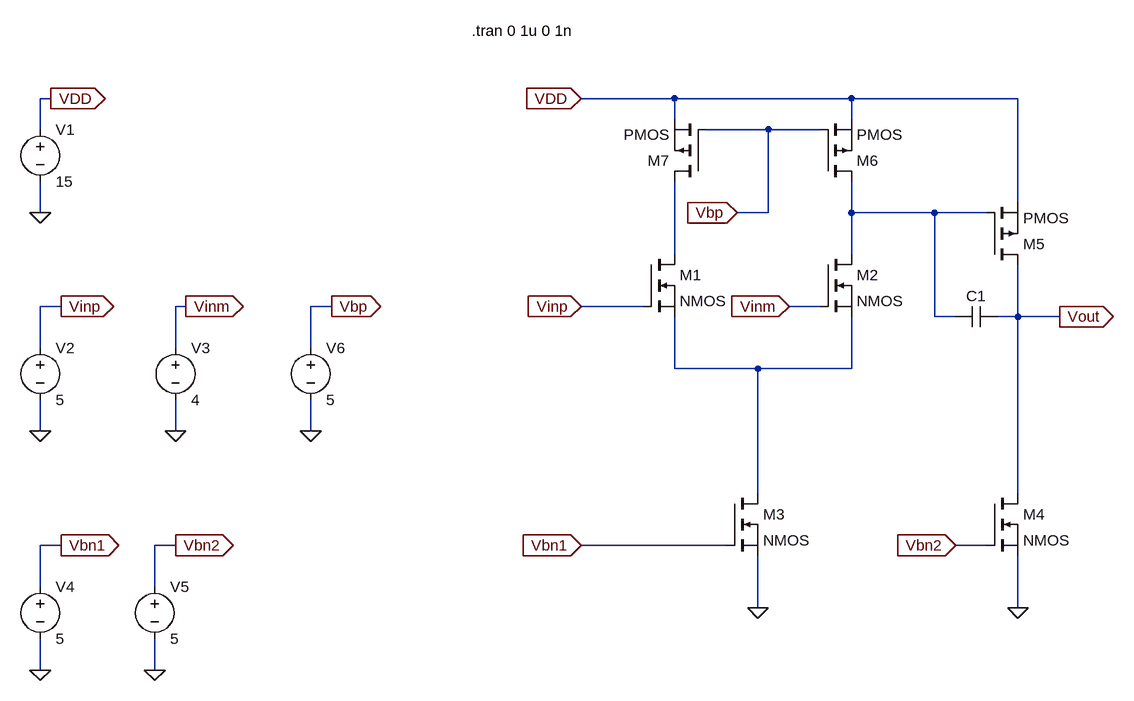
[diagram p0: schematic Report3.asc]
Report3.asc, the LTspice schematic file:
Version 4
SHEET 1 880 1092
WIRE -912 80 -928 80
WIRE 48 80 -96 80
WIRE 320 80 48 80
WIRE 576 80 320 80
WIRE 48 112 48 80
WIRE 320 112 320 80
WIRE -928 128 -928 80
WIRE 192 128 96 128
WIRE 272 128 192 128
WIRE 576 240 576 80
WIRE -928 256 -928 208
WIRE 192 256 192 128
WIRE 192 256 144 256
WIRE 320 256 320 208
WIRE 448 256 320 256
WIRE 528 256 448 256
WIRE 48 320 48 208
WIRE 320 320 320 256
WIRE -896 400 -928 400
WIRE -704 400 -720 400
WIRE -480 400 -512 400
WIRE 0 400 -96 400
WIRE 272 400 224 400
WIRE 448 416 448 256
WIRE 480 416 448 416
WIRE 576 416 576 336
WIRE 576 416 544 416
WIRE 640 416 576 416
WIRE -928 464 -928 400
WIRE -720 464 -720 400
WIRE -512 464 -512 400
WIRE 48 496 48 416
WIRE 176 496 48 496
WIRE 320 496 320 416
WIRE 320 496 176 496
WIRE -928 592 -928 544
WIRE -720 592 -720 544
WIRE -512 592 -512 544
WIRE 176 688 176 496
WIRE 576 688 576 416
WIRE -896 768 -928 768
WIRE -720 768 -752 768
WIRE 128 768 -96 768
WIRE 528 768 480 768
WIRE -928 832 -928 768
WIRE -752 832 -752 768
WIRE 176 864 176 784
WIRE 576 864 576 784
WIRE -928 960 -928 912
WIRE -752 960 -752 912
FLAG -96 80 VDD
IOPIN -96 80 In
FLAG -96 400 Vinp
IOPIN -96 400 In
FLAG 224 400 Vinm
IOPIN 224 400 In
FLAG -96 768 Vbn1
IOPIN -96 768 In
FLAG 480 768 Vbn2
IOPIN 480 768 In
FLAG 176 864 0
FLAG 576 864 0
FLAG 640 416 Vout
IOPIN 640 416 Out
FLAG 144 256 Vbp
IOPIN 144 256 In
FLAG -928 592 0
FLAG -720 592 0
FLAG -928 960 0
FLAG -752 960 0
FLAG -928 256 0
FLAG -896 400 Vinp
IOPIN -896 400 Out
FLAG -704 400 Vinm
IOPIN -704 400 Out
FLAG -896 768 Vbn1
IOPIN -896 768 Out
FLAG -720 768 Vbn2
IOPIN -720 768 Out
FLAG -912 80 VDD
IOPIN -912 80 Out
FLAG -512 592 0
FLAG -480 400 Vbp
IOPIN -480 400 Out
SYMBOL nmos 0 320 R0
SYMATTR InstName M1
SYMBOL nmos 272 320 R0
SYMATTR InstName M2
SYMBOL nmos 128 688 R0
SYMATTR InstName M3
SYMBOL nmos 528 688 R0
SYMATTR InstName M4
SYMBOL cap 480 432 R270
WINDOW 0 32 32 VTop 2
WINDOW 3 -3 33 VBottom 2
SYMATTR InstName C1
SYMATTR Value ""
SYMBOL pmos 528 336 M180
SYMATTR InstName M5
SYMBOL pmos 272 208 M180
SYMATTR InstName M6
SYMBOL pmos 96 208 R180
SYMATTR InstName M7
SYMBOL voltage -928 112 R0
WINDOW 123 0 0 Left 0
WINDOW 39 0 0 Left 0
SYMATTR InstName V1
SYMATTR Value 15
SYMBOL voltage -928 448 R0
WINDOW 123 0 0 Left 0
WINDOW 39 0 0 Left 0
SYMATTR InstName V2
SYMATTR Value 5
SYMBOL voltage -720 448 R0
WINDOW 123 0 0 Left 0
WINDOW 39 0 0 Left 0
SYMATTR InstName V3
SYMATTR Value 4
SYMBOL voltage -928 816 R0
WINDOW 123 0 0 Left 0
WINDOW 39 0 0 Left 0
SYMATTR InstName V4
SYMATTR Value 5
SYMBOL voltage -752 816 R0
WINDOW 123 0 0 Left 0
WINDOW 39 0 0 Left 0
SYMATTR InstName V5
SYMATTR Value 5
SYMBOL voltage -512 448 R0
WINDOW 123 0 0 Left 0
WINDOW 39 0 0 Left 0
SYMATTR InstName V6
SYMATTR Value 5
TEXT -264 -24 Left 2 !.tran 0 1u 0 1n

The netlist it stands for:
* Report3.asc
M1 N002 Vinp N003 N003 NMOS
M2 N001 Vinm N003 N003 NMOS
M3 N003 Vbn1 0 0 NMOS
M4 Vout Vbn2 0 0 NMOS
C1 N001 Vout
M5 Vout N001 VDD VDD PMOS
M6 N001 Vbp VDD VDD PMOS
M7 N002 Vbp VDD VDD PMOS
V1 VDD 0 15
V2 Vinp 0 5
V3 Vinm 0 4
V4 Vbn1 0 5
V5 Vbn2 0 5
V6 Vbp 0 5
.model NMOS NMOS
.model PMOS PMOS
.lib standard.mos
.tran 0 1u 0 1n
.backanno
.end